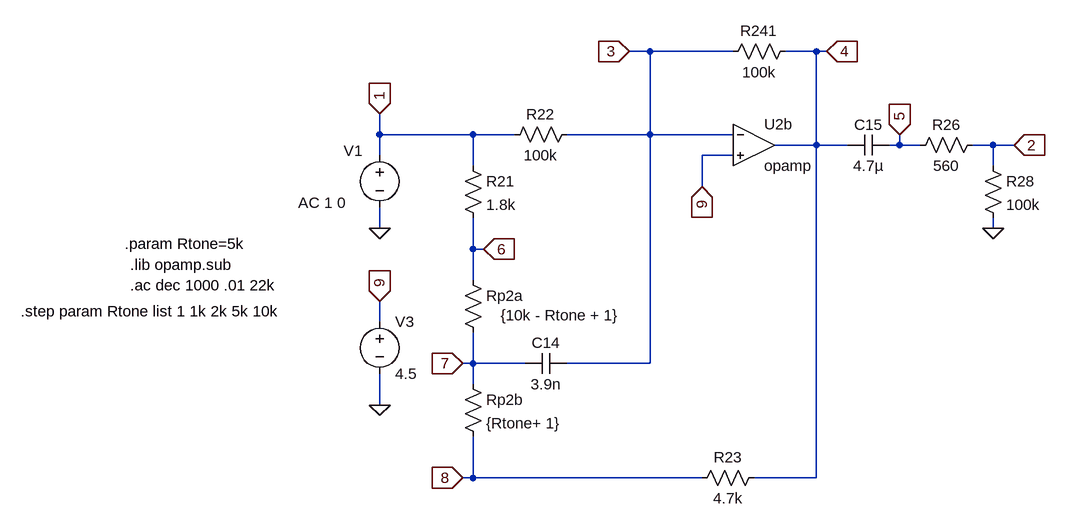
[diagram p0: schematic Klon-Centaur_treble-OLD.asc]
Klon-Centaur_treble-OLD.asc, the LTspice schematic file:
Version 4
SHEET 1 4496 5064
WIRE 3600 2672 3568 2672
WIRE 3728 2672 3600 2672
WIRE 3856 2672 3808 2672
WIRE 3872 2672 3856 2672
WIRE 3184 2800 3184 2768
WIRE 3328 2800 3184 2800
WIRE 3392 2800 3328 2800
WIRE 3600 2800 3600 2672
WIRE 3600 2800 3472 2800
WIRE 3728 2800 3600 2800
WIRE 3856 2816 3856 2672
WIRE 3856 2816 3792 2816
WIRE 3904 2816 3856 2816
WIRE 3984 2816 3984 2800
WIRE 3984 2816 3968 2816
WIRE 4016 2816 3984 2816
WIRE 4128 2816 4096 2816
WIRE 4160 2816 4128 2816
WIRE 3184 2832 3184 2800
WIRE 3728 2832 3680 2832
WIRE 3328 2848 3328 2800
WIRE 4128 2848 4128 2816
WIRE 3680 2880 3680 2832
WIRE 3184 2944 3184 2912
WIRE 4128 2944 4128 2928
WIRE 3328 2976 3328 2928
WIRE 3344 2976 3328 2976
WIRE 3328 3024 3328 2976
WIRE 3184 3088 3184 3056
WIRE 3328 3152 3328 3104
WIRE 3328 3152 3312 3152
WIRE 3408 3152 3328 3152
WIRE 3600 3152 3600 2800
WIRE 3600 3152 3472 3152
WIRE 3328 3184 3328 3152
WIRE 3184 3216 3184 3168
WIRE 3328 3328 3328 3264
WIRE 3328 3328 3312 3328
WIRE 3680 3328 3328 3328
WIRE 3856 3328 3856 2816
WIRE 3856 3328 3760 3328
FLAG 3184 2768 1
IOPIN 3184 2768 In
FLAG 3680 2880 9
IOPIN 3680 2880 In
FLAG 4160 2816 2
IOPIN 4160 2816 In
FLAG 3184 3216 0
FLAG 3184 3056 9
IOPIN 3184 3056 In
FLAG 3184 2944 0
FLAG 4128 2944 0
FLAG 3344 2976 6
IOPIN 3344 2976 In
FLAG 3312 3152 7
IOPIN 3312 3152 In
FLAG 3312 3328 8
IOPIN 3312 3328 In
FLAG 3568 2672 3
IOPIN 3568 2672 In
FLAG 3872 2672 4
IOPIN 3872 2672 In
FLAG 3984 2800 5
IOPIN 3984 2800 In
SYMBOL voltage 3184 2816 R0
WINDOW 0 -55 9 Left 2
WINDOW 123 -125 89 Left 2
WINDOW 39 0 0 Left 0
WINDOW 3 -289 58 Left 2
SYMATTR InstName V1
SYMATTR Value2 AC 1 0
SYMATTR Value ""
SYMBOL res 3312 2832 R0
SYMATTR InstName R21
SYMATTR Value 1.8k
SYMBOL res 3488 2784 R90
WINDOW 0 0 56 VBottom 2
WINDOW 3 32 56 VTop 2
SYMATTR InstName R22
SYMATTR Value 100k
SYMBOL res 3312 3008 R0
WINDOW 3 241 70 Right 2
SYMATTR Value {10k - Rtone + 1}
SYMATTR InstName Rp2a
SYMBOL res 3312 3168 R0
SYMATTR InstName Rp2b
SYMATTR Value {Rtone+ 1}
SYMBOL cap 3472 3136 R90
WINDOW 0 0 32 VBottom 2
WINDOW 3 32 32 VTop 2
SYMATTR InstName C14
SYMATTR Value 3.9n
SYMBOL res 3824 2656 R90
WINDOW 0 0 56 VBottom 2
WINDOW 3 32 56 VTop 2
SYMATTR InstName R241
SYMATTR Value 100k
SYMBOL res 4112 2800 R90
WINDOW 0 0 56 VBottom 2
WINDOW 3 32 56 VTop 2
SYMATTR InstName R26
SYMATTR Value 560
SYMBOL voltage 3184 3072 R0
WINDOW 123 0 0 Left 0
WINDOW 39 0 0 Left 0
SYMATTR InstName V3
SYMATTR Value 4.5
SYMBOL res 3776 3312 R90
WINDOW 0 0 56 VBottom 2
WINDOW 3 32 56 VTop 2
SYMATTR InstName R23
SYMATTR Value 4.7k
SYMBOL cap 3968 2800 R90
WINDOW 0 0 32 VBottom 2
WINDOW 3 32 32 VTop 2
SYMATTR InstName C15
SYMATTR Value 4.7µ
SYMBOL OpAmps\\opamp 3760 2752 R0
SYMATTR InstName U2b
SYMBOL res 4112 2832 R0
SYMATTR InstName R28
SYMATTR Value 100k
TEXT 2792 2968 Left 2 !.param Rtone=5k
TEXT 2800 3000 Left 2 !.lib opamp.sub
TEXT 2800 3032 Left 2 !.ac dec 1000 .01 22k
TEXT 2632 3072 Left 2 !.step param Rtone list 1 1k 2k 5k 10k

The netlist it stands for:
* Klon-Centaur_treble-OLD.asc
V1 1 0 AC 1 0
R21 1 6 1.8k
R22 3 1 100k
Rp2a 6 7 {10k - Rtone + 1}
Rp2b 7 8 {Rtone+ 1}
C14 3 7 3.9n
R241 4 3 100k
R26 2 5 560
V3 9 0 4.5
R23 4 8 4.7k
C15 5 4 4.7µ
XU2b 3 9 4 opamp Aol=100K GBW=10Meg  ; pins invin noninvin out
R28 2 0 100k
.param Rtone=5k
.lib opamp.sub
.ac dec 1000 .01 22k
.step param Rtone list 1 1k 2k 5k 10k
.backanno
.end